# EAGLE design PCB-CMB-2 (EAGLE 6.4)

## Sheet 1 of 2
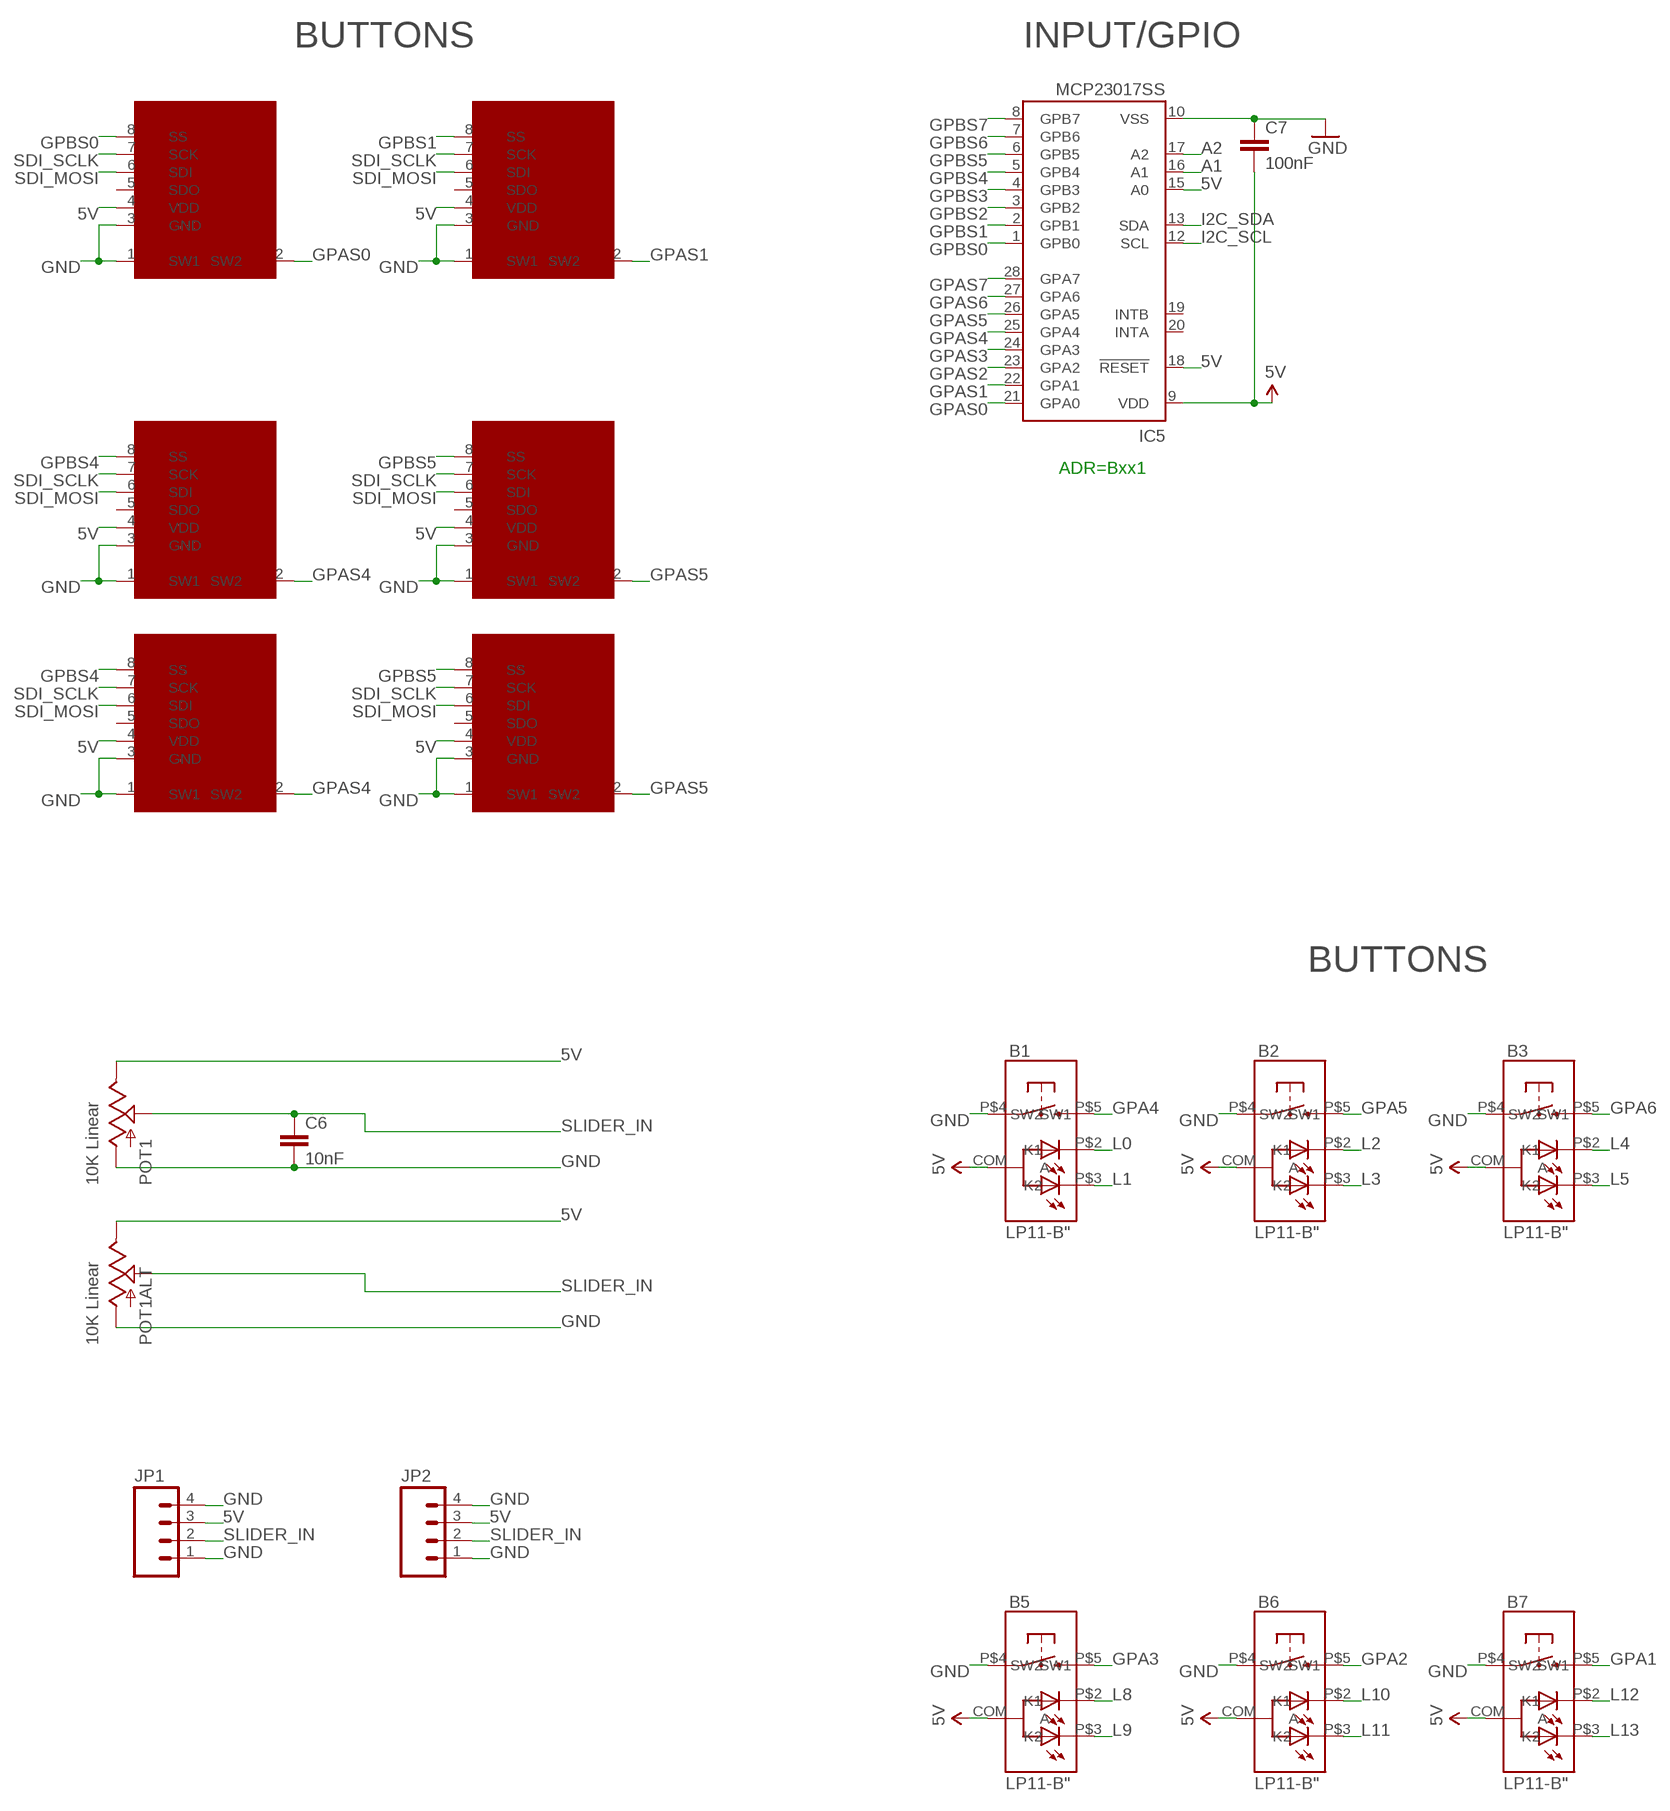
[diagram p0: schematic, sheet 1, part 1 of 2]
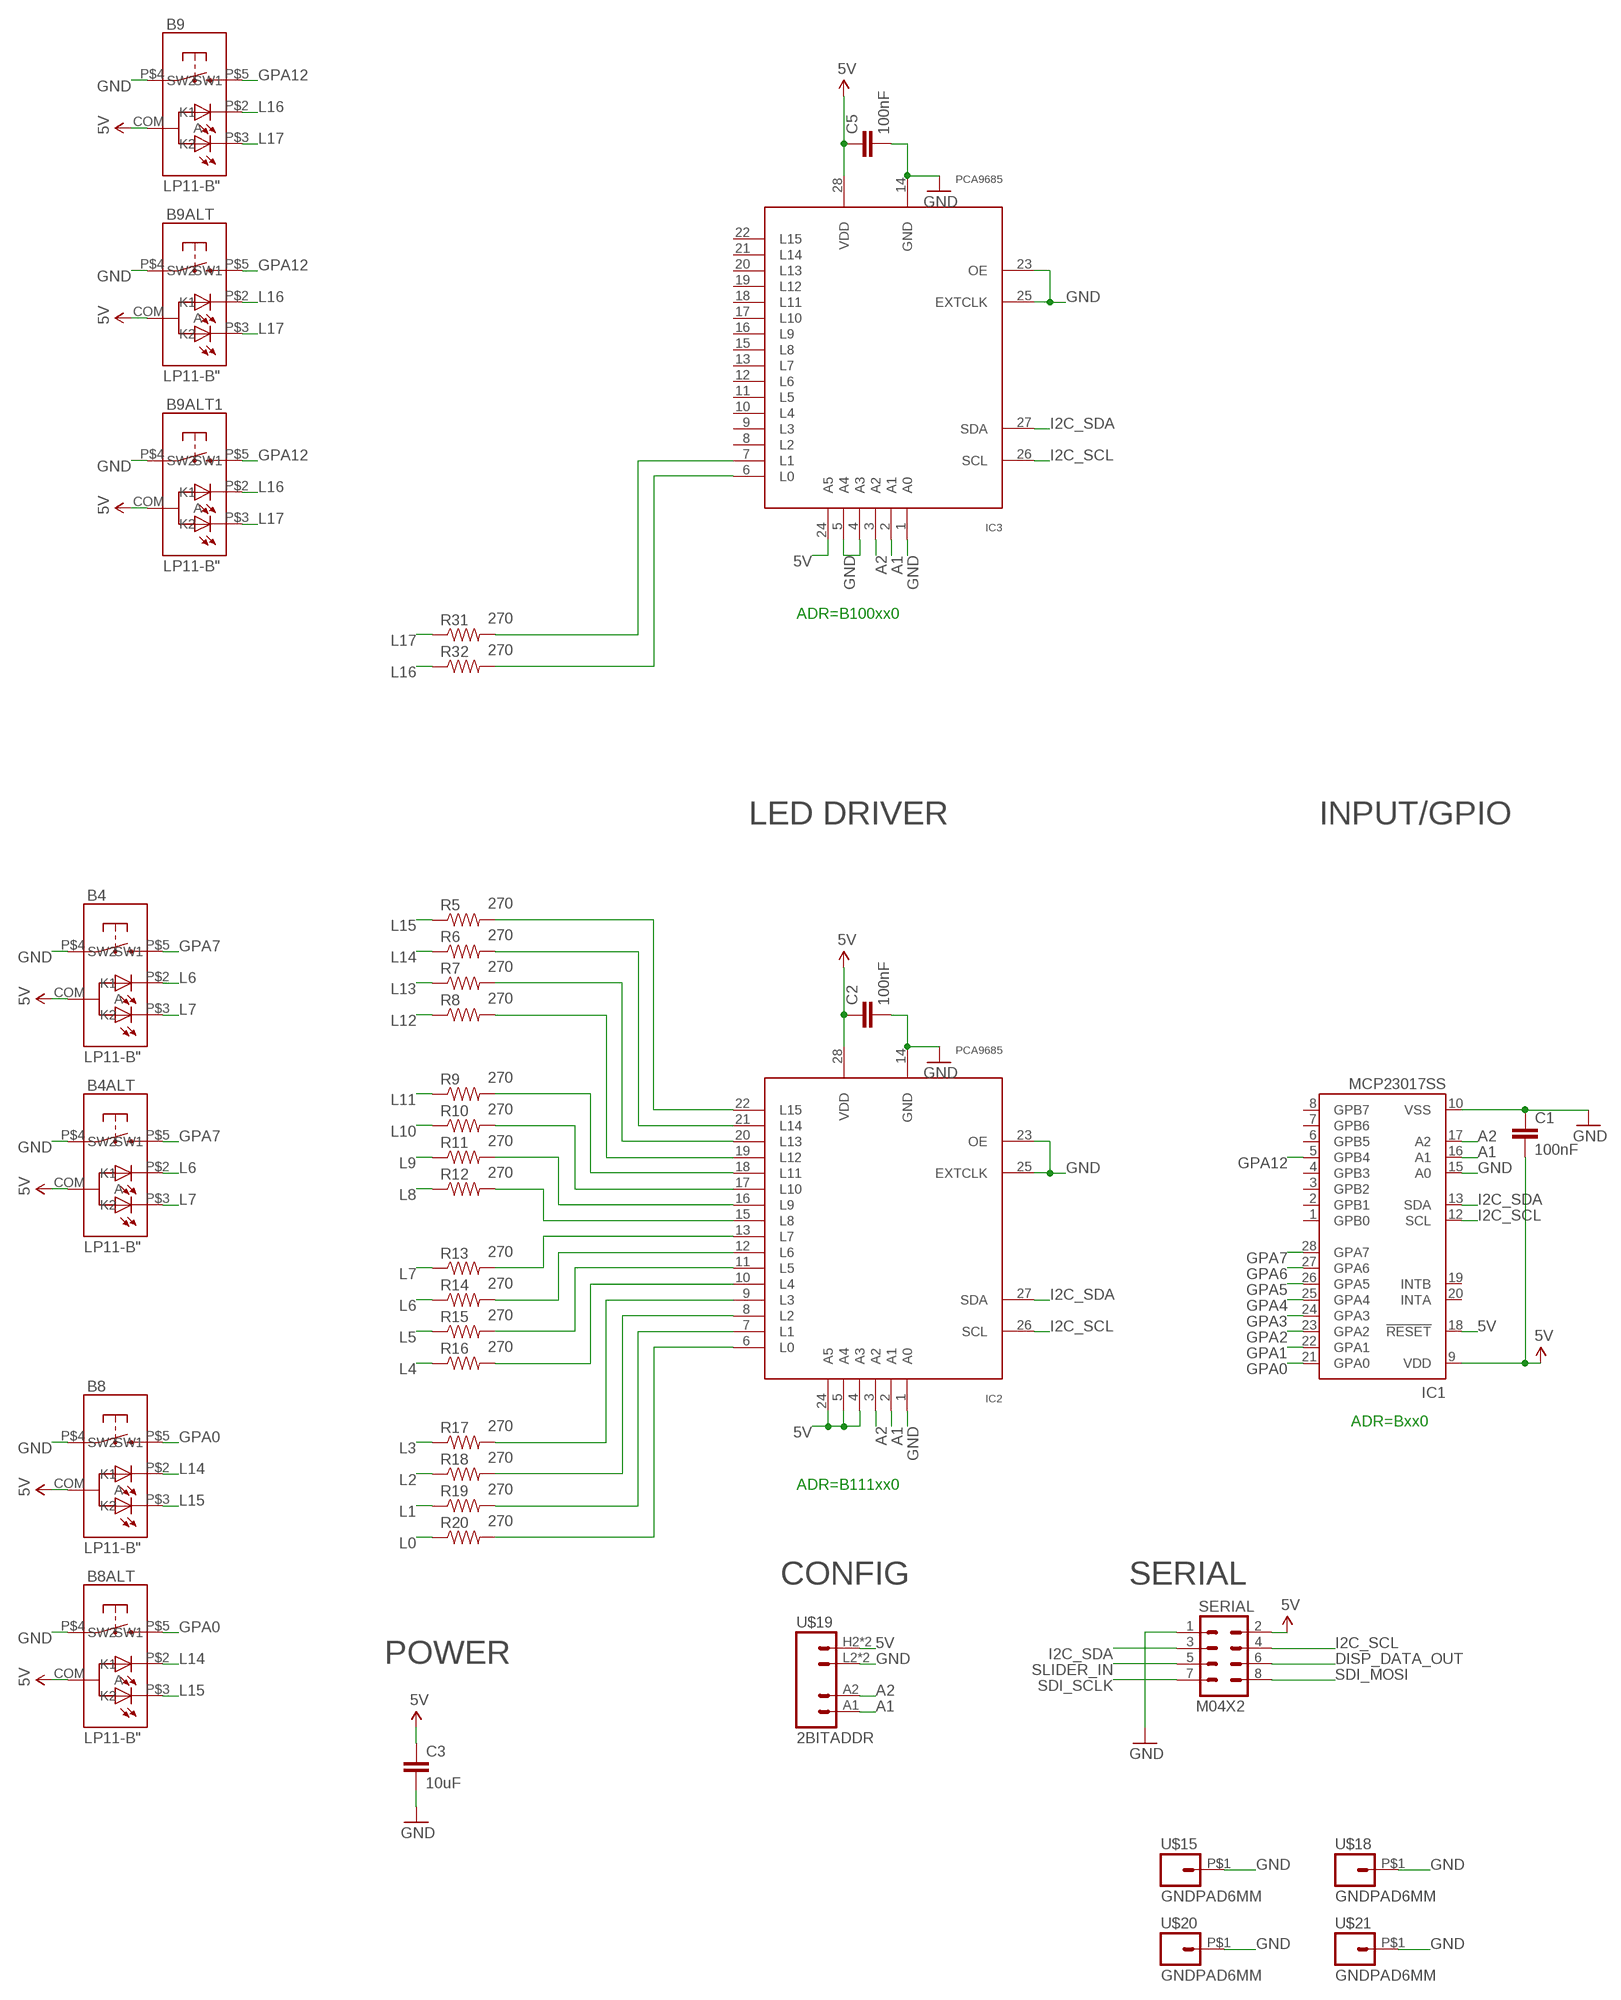
[diagram p1: schematic, sheet 1, part 2 of 2]

### Parts
B1  LP11-B"  [LP11]
B2  LP11-B"  [LP11]
B3  LP11-B"  [LP11]
B4  LP11-B"  [LP11]
B4ALT  LP11-B"  [LP11]
B5  LP11-B"  [LP11]
B6  LP11-B"  [LP11]
B7  LP11-B"  [LP11]
B8  LP11-B"  [LP11]
B8ALT  LP11-B"  [LP11]
B9  LP11-B"  [LP11]
B9ALT  LP11-B"  [LP11]
B9ALT1  LP11-B"  [LP11]
C1  100nF  CAP0603-CAP  [0603-CAP]
C2  100nF  CAP0603-CAP  [0603-CAP]
C3  10uF  CAP0805  [0805]
C5  100nF  CAP0603-CAP  [0603-CAP]
C6  10nF  CAP0603-CAP  [0603-CAP]
C7  100nF  CAP0603-CAP  [0603-CAP]
IC1  MCP23017SS  [SSOP28]
IC2  PCA9685  [TSSOP28]
IC3  PCA9685  [TSSOP28]
IC5  MCP23017SS  [SSOP28]
JP1  M04PTH  [1X04]
JP2  M04PTH  [1X04]
POT1  10K Linear  SLIDER20  [SLIDER20]
POT1ALT  10K Linear  SLIDER20  [SLIDER20]
R5  270  RESISTOR0603-RES  [0603-RES]
R6  270  RESISTOR0603-RES  [0603-RES]
R7  270  RESISTOR0603-RES  [0603-RES]
R8  270  RESISTOR0603-RES  [0603-RES]
R9  270  RESISTOR0603-RES  [0603-RES]
R10  270  RESISTOR0603-RES  [0603-RES]
R11  270  RESISTOR0603-RES  [0603-RES]
R12  270  RESISTOR0603-RES  [0603-RES]
R13  270  RESISTOR0603-RES  [0603-RES]
R14  270  RESISTOR0603-RES  [0603-RES]
R15  270  RESISTOR0603-RES  [0603-RES]
R16  270  RESISTOR0603-RES  [0603-RES]
R17  270  RESISTOR0603-RES  [0603-RES]
R18  270  RESISTOR0603-RES  [0603-RES]
R19  270  RESISTOR0603-RES  [0603-RES]
R20  270  RESISTOR0603-RES  [0603-RES]
R31  270  RESISTOR0603-RES  [0603-RES]
R32  270  RESISTOR0603-RES  [0603-RES]
SERIAL  M04X2  [2X4]
SSW1  SMART_SWITCHSMART_SWITCH_8PIN  [SMART_SWITCH]
SSW2  SMART_SWITCHSMART_SWITCH_8PIN  [SMART_SWITCH]
SSW5  SMART_SWITCHSMART_SWITCH_8PIN  [SMART_SWITCH]
SSW5ALT  SMART_SWITCHSMART_SWITCH_8PIN  [SMART_SWITCH]
SSW6  SMART_SWITCHSMART_SWITCH_8PIN  [SMART_SWITCH]
SSW6ALT  SMART_SWITCHSMART_SWITCH_8PIN  [SMART_SWITCH]
U$15  GNDPAD6MM  [3.2MMPAD6MM]
U$18  GNDPAD6MM  [3.2MMPAD6MM]
U$19  2BITADDR  [2BITADDR]
U$20  GNDPAD6MM  [3.2MMPAD6MM]
U$21  GNDPAD6MM  [3.2MMPAD6MM]

### Nets
5V [Power]: B1.COM(A) B2.COM(A) B3.COM(A) B4.COM(A) B4ALT.COM(A) B5.COM(A) B6.COM(A) B7.COM(A) B8.COM(A) B8ALT.COM(A) B9.COM(A) B9ALT1.COM(A) B9ALT.COM(A) C1.2 C2.1 C3.1 C5.1 C7.2 IC1.9(VDD) IC1.18(!RESET) IC2.4(A3) IC2.5(A4) IC2.24(A5) IC2.28(VDD) IC3.24(A5) IC3.28(VDD) IC5.9(VDD) IC5.15(A0) IC5.18(!RESET) JP1.3 JP2.3 POT1.1(E) POT1ALT.1(E) SERIAL.2 SSW1.4(VDD) SSW2.4(VDD) SSW5.4(VDD) SSW5ALT.4(VDD) SSW6.4(VDD) SSW6ALT.4(VDD) U$19.H2(VCC) U$19.H3(VCC)
A1: IC1.16(A1) IC2.2(A1) IC3.2(A1) IC5.16(A1) U$19.A1
A2: IC1.17(A2) IC2.3(A2) IC3.3(A2) IC5.17(A2) U$19.A2
DISP_DATA_OUT: SERIAL.6
GND [Power]: B1.P$4(SW1) B2.P$4(SW1) B3.P$4(SW1) B4.P$4(SW1) B4ALT.P$4(SW1) B5.P$4(SW1) B6.P$4(SW1) B7.P$4(SW1) B8.P$4(SW1) B8ALT.P$4(SW1) B9.P$4(SW1) B9ALT1.P$4(SW1) B9ALT.P$4(SW1) C1.1 C2.2 C3.2 C5.2 C6.2 C7.1 IC1.10(VSS) IC1.15(A0) IC2.1(A0) IC2.14(GND) IC2.23(OE) IC2.25(EXTCLK) IC3.1(A0) IC3.4(A3) IC3.5(A4) IC3.14(GND) IC3.23(OE) IC3.25(EXTCLK) IC5.10(VSS) JP1.1 JP1.4 JP2.1 JP2.4 POT1.3(A) POT1ALT.3(A) SERIAL.1 SSW1.1(SW1) SSW1.3(GND) SSW2.1(SW1) SSW2.3(GND) SSW5.1(SW1) SSW5.3(GND) SSW5ALT.1(SW1) SSW5ALT.3(GND) SSW6.1(SW1) SSW6.3(GND) SSW6ALT.1(SW1) SSW6ALT.3(GND) U$15.P$1 U$18.P$1 U$19.L2(GND) U$19.L3(GND) U$20.P$1 U$21.P$1
GPA0: B8.P$5(SW2) B8ALT.P$5(SW2) IC1.21(GPA0)
GPA1: B7.P$5(SW2) IC1.22(GPA1)
GPA2: B6.P$5(SW2) IC1.23(GPA2)
GPA3: B5.P$5(SW2) IC1.24(GPA3)
GPA4: B1.P$5(SW2) IC1.25(GPA4)
GPA5: B2.P$5(SW2) IC1.26(GPA5)
GPA6: B3.P$5(SW2) IC1.27(GPA6)
GPA7: B4.P$5(SW2) B4ALT.P$5(SW2) IC1.28(GPA7)
GPA12: B9.P$5(SW2) B9ALT1.P$5(SW2) B9ALT.P$5(SW2) IC1.5(GPB4)
GPAS0: IC5.21(GPA0) SSW1.2(SW2)
GPAS1: IC5.22(GPA1) SSW2.2(SW2)
GPAS2: IC5.23(GPA2)
GPAS3: IC5.24(GPA3)
GPAS4: IC5.25(GPA4) SSW5.2(SW2) SSW5ALT.2(SW2)
GPAS5: IC5.26(GPA5) SSW6.2(SW2) SSW6ALT.2(SW2)
GPAS6: IC5.27(GPA6)
GPAS7: IC5.28(GPA7)
GPBS0: IC5.1(GPB0) SSW1.8(SS)
GPBS1: IC5.2(GPB1) SSW2.8(SS)
GPBS2: IC5.3(GPB2)
GPBS3: IC5.4(GPB3)
GPBS4: IC5.5(GPB4) SSW5.8(SS) SSW5ALT.8(SS)
GPBS5: IC5.6(GPB5) SSW6.8(SS) SSW6ALT.8(SS)
GPBS6: IC5.7(GPB6)
GPBS7: IC5.8(GPB7)
I2C_SCL: IC1.12(SCL) IC2.26(SCL) IC3.26(SCL) IC5.12(SCL) SERIAL.4
I2C_SDA: IC1.13(SDA) IC2.27(SDA) IC3.27(SDA) IC5.13(SDA) SERIAL.3
L0: B1.P$2(K1) R20.1
L1: B1.P$3(K2) R19.1
L2: B2.P$2(K1) R18.1
L3: B2.P$3(K2) R17.1
L4: B3.P$2(K1) R16.1
L5: B3.P$3(K2) R15.1
L6: B4.P$2(K1) B4ALT.P$2(K1) R14.1
L7: B4.P$3(K2) B4ALT.P$3(K2) R13.1
L8: B5.P$2(K1) R12.1
L9: B5.P$3(K2) R11.1
L10: B6.P$2(K1) R10.1
L11: B6.P$3(K2) R9.1
L12: B7.P$2(K1) R8.1
L13: B7.P$3(K2) R7.1
L14: B8.P$2(K1) B8ALT.P$2(K1) R6.1
L15: B8.P$3(K2) B8ALT.P$3(K2) R5.1
L16: B9.P$2(K1) B9ALT1.P$2(K1) B9ALT.P$2(K1) R32.1
L17: B9.P$3(K2) B9ALT1.P$3(K2) B9ALT.P$3(K2) R31.1
N$4: IC2.13(L7) R13.2
N$5: IC2.12(L6) R14.2
N$7: IC2.11(L5) R15.2
N$9: IC2.10(L4) R16.2
N$10: IC2.9(L3) R17.2
N$11: IC2.8(L2) R18.2
N$12: IC2.7(L1) R19.2
N$14: IC3.7(L1) R31.2
N$15: IC3.6(L0) R32.2
N$19: IC2.6(L0) R20.2
N$20: IC2.15(L8) R12.2
N$21: IC2.16(L9) R11.2
N$22: IC2.17(L10) R10.2
N$23: IC2.18(L11) R9.2
N$24: IC2.19(L12) R8.2
N$25: IC2.20(L13) R7.2
N$26: IC2.21(L14) R6.2
N$27: IC2.22(L15) R5.2
SDI_MOSI: SERIAL.8 SSW1.6(SDI) SSW2.6(SDI) SSW5.6(SDI) SSW5ALT.6(SDI) SSW6.6(SDI) SSW6ALT.6(SDI)
SDI_SCLK: SERIAL.7 SSW1.7(SCK) SSW2.7(SCK) SSW5.7(SCK) SSW5ALT.7(SCK) SSW6.7(SCK) SSW6ALT.7(SCK)
SLIDER_IN: C6.1 JP1.2 JP2.2 POT1.2A(S) POT1ALT.2A(S) SERIAL.5
Unconnected: IC1.1(GPB0) IC1.2(GPB1) IC1.3(GPB2) IC1.4(GPB3) IC1.6(GPB5) IC1.7(GPB6) IC1.8(GPB7) IC1.19(INTB) IC1.20(INTA) IC3.8(L2) IC3.9(L3) IC3.10(L4) IC3.11(L5) IC3.12(L6) IC3.13(L7) IC3.15(L8) IC3.16(L9) IC3.17(L10) IC3.18(L11) IC3.19(L12) IC3.20(L13) IC3.21(L14) IC3.22(L15) IC5.19(INTB) IC5.20(INTA) SSW1.5(SDO) SSW2.5(SDO) SSW5.5(SDO) SSW5ALT.5(SDO) SSW6.5(SDO) SSW6ALT.5(SDO)

### Notes on the sheet
- BUTTONS | INPUT/GPIO
- ADR=Bxx1
- ADR=B100xx0
- BUTTONS | LED DRIVER | INPUT/GPIO
- ADR=Bxx0
- ADR=B111xx0
- CONFIG | SERIAL
- POWER

## Sheet 2 of 2

## Library data of the parts
B1-B4 B4ALT B5-B8 B8ALT B9 B9ALT B9ALT1 = SKAARHOJ:LP11-B
C1-C3 C5-C7 = SparkFun:CAP: Capacitor Standard 0603 ceramic capacitor, and 0.1" leaded capacitor.
IC1 IC5 = microchip:MCP23017: http://ww1.microchip.com/downloads/en/DeviceDoc/21952a.pdf Source: http://ww1.microchip.com/downloads/en/DeviceDoc/21952a.pdf; MF: MICROCHIP; MPN: MCP23017-E/SS; OC_FARNELL: 1467674; OC_NEWARK: 31K2960
IC2 IC3 = wsmith:PCA9685
JP1 JP2 = SparkFun:M04: Header 4 Standard 4-pin 0.1" header. Use with straight break away headers (SKU : PRT-00116), right angle break away headers (PRT-00553), swiss pins (PRT-00743), machine pins (PRT-00117), and female headers (PRT-00115). Molex polarized connector foot print use with SKU : PRT-08231 with associated crimp pins and housings. 1MM SMD Version SKU: PRT-10208
POT1 POT1ALT = SKAARHOJ:SLIDER
R5-R20 R31 R32 = SparkFun:RESISTOR: Resistor Basic schematic elements and footprints for 0603, 1206, and PTH resistors.
SERIAL = SparkFun:M04X2
SSW1 SSW2 SSW5 SSW5ALT SSW6 SSW6ALT = SKAARHOJ:SMART_SWITCH: SMARTSWITCH IS15DSBFP4RGB www.nkksmartswitch.com
U$15 U$18 U$20 U$21 = SKAARHOJ:GNDPAD
U$19 = SKAARHOJ:2BITADDR

## Net classes
0 default: width 0.203 mm, drill 0.406 mm, clearance 0.203 mm
1 Power: width 0.406 mm, drill 0.61 mm, clearance 0.203 mm

## Board
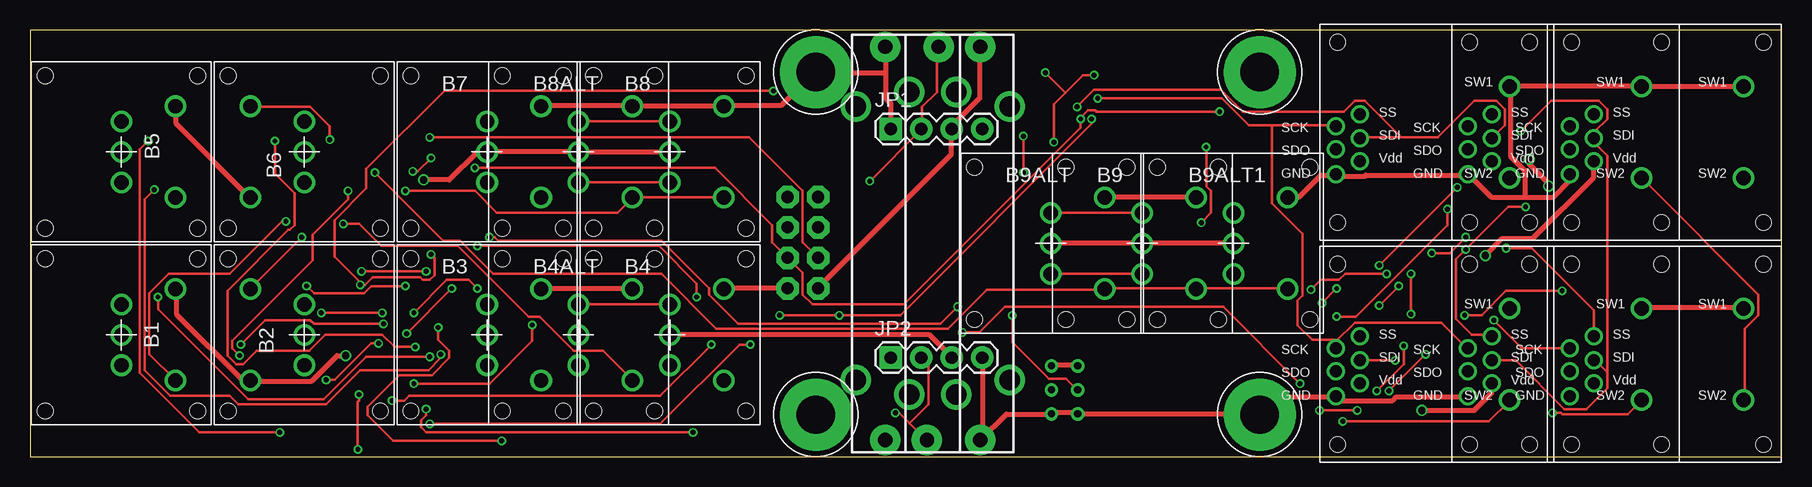
[diagram p2: board, top side]
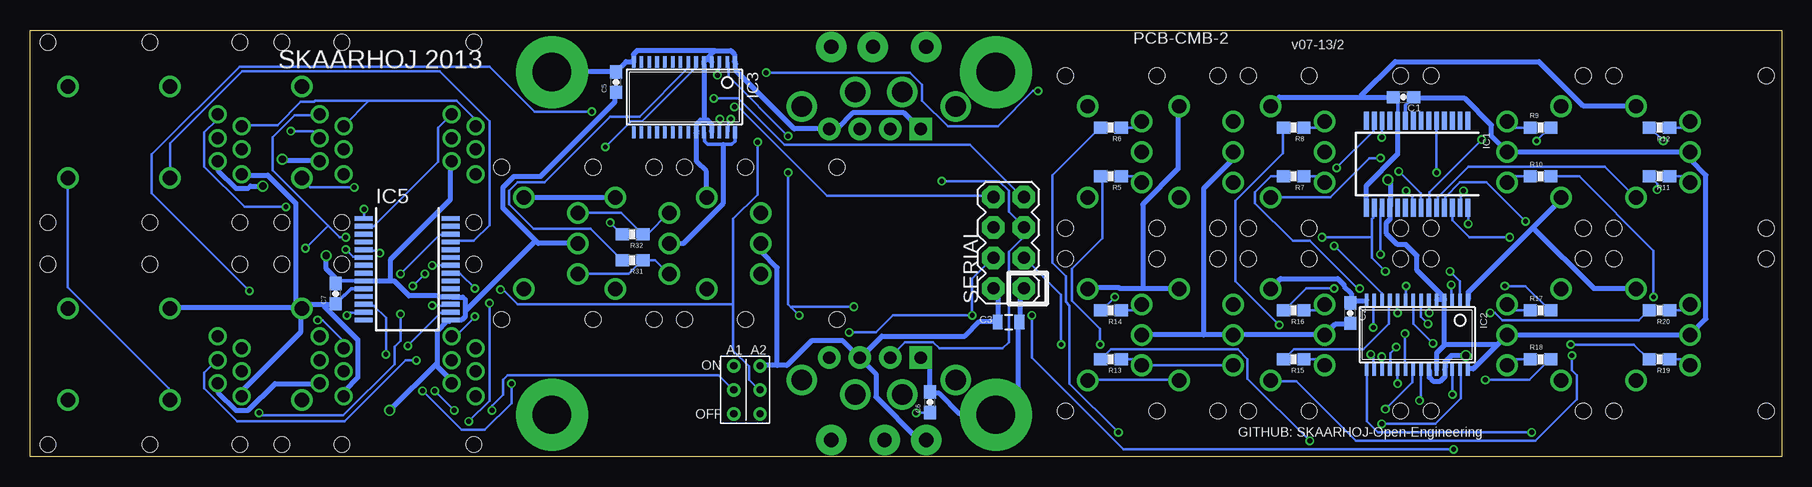
[diagram p3: board, bottom side, seen from below]

Size 146 x 35.56 mm. Coordinates in mm from the lower left corner, seen from the top.
Outline: 0,0 146,0 146,35.56 0,35.56 0,0
Copper layers (1*16): Top 0.035mm / dielectric 1.5mm / Bottom 0.035mm
Design rules "Fusion_eagle_rule_v1.1": minimum track width 6mil, minimum drill 12mil, track to track 6mil, track to pad 6mil, pad to pad 6mil, via to via 6mil, smd to smd 0mil, copper to edge 10mil, drill to drill 10mil, minimum pad ring 10mil, minimum via ring 6mil, stop-mask expansion 2mil, vias tented up to drill 100mil, thermal gap 10mil

### Footprints (pad centres in the part's own frame; a part is rotated, then mirrored left to right if it is on the bottom)
LP11 = drill 1.2: COM 0,0; P$2 0,2.54; P$3 0,-2.54; P$4 4.5,3.81; P$5 4.5,-3.81 | hole 1.3: -6.35,6.35; 6.35,6.35; 6.35,-6.35; -6.35,-6.35
0603-CAP = smd 1.1 x 1: 1 -0.85,0; 2 0.85,0
0805 = smd 0.8 x 1.2: 1 -0.9,0; 2 0.9,0
SSOP28 = smd 0.4 x 1.5: 1 -4.225,-3.625; 2 -3.575,-3.625; 3 -2.925,-3.625; 4 -2.275,-3.625; 5 -1.625,-3.625; 6 -0.975,-3.625; 7 -0.325,-3.625; 8 0.325,-3.625; 9 0.975,-3.625; 10 1.625,-3.625; 11 2.275,-3.625; 12 2.925,-3.625; 13 3.575,-3.625; 14 4.225,-3.625; 15 4.225,3.625; 16 3.575,3.625; 17 2.925,3.625; 18 2.275,3.625; 19 1.625,3.625; 20 0.975,3.625; 21 0.325,3.625; 22 -0.325,3.625; 23 -0.975,3.625; 24 -1.625,3.625; 25 -2.275,3.625; 26 -2.925,3.625; 27 -3.575,3.625; 28 -4.225,3.625
TSSOP28 = smd 0.305 x 0.991: 1 -4.225,-2.918; 2 -3.575,-2.918; 3 -2.925,-2.918; 4 -2.275,-2.918; 5 -1.625,-2.918; 6 -0.975,-2.918; 7 -0.325,-2.918; 8 0.325,-2.918; 9 0.975,-2.918; 10 1.625,-2.918; 11 2.275,-2.918; 12 2.925,-2.918; 13 3.575,-2.918; 14 4.225,-2.918; 15 4.225,2.918; 16 3.575,2.918; 17 2.925,2.918; 18 2.275,2.918; 19 1.625,2.918; 20 0.975,2.918; 21 0.325,2.918; 22 -0.325,2.918; 23 -0.975,2.918; 24 -1.625,2.918; 25 -2.275,2.918; 26 -2.925,2.918; 27 -3.575,2.918; 28 -4.225,2.918
1X04 = drill 1.016 pad 1.88 square: 1 0,0 | drill 1.016 pad 1.88: 2 2.54,0; 3 5.08,0; 4 7.62,0
SLIDER20 = drill 1.194 pad 2.54: 1 -16.383,1.74; 2A -16.383,-1.74; 3 16.383,1.74 | drill 1.702: P$1 -11.392,4.191; P$2 11.392,4.191; P$3 12.598,-4.191; P$4 -12.598,-4.191
0603-RES = smd 1.1 x 1: 1 -0.85,0; 2 0.85,0
2X4 = drill 1.016 pad 1.88 octagon: 1 -3.81,-1.27; 2 -3.81,1.27; 3 -1.27,-1.27; 4 -1.27,1.27; 5 1.27,-1.27; 6 1.27,1.27; 7 3.81,-1.27; 8 3.81,1.27
SMART_SWITCH = drill 1.2: 1 6.35,3.81; 2 6.35,-3.81 | drill 1: 3 -8.153,-3.48; 4 -6.147,-2.413; 5 -8.153,-1.422; 6 -6.147,-0.483; 7 -8.153,0.508; 8 -6.147,1.499 | hole 1.3: -8.001,7.506; 8.001,7.506; 8.001,-7.506; -8.001,-7.506
3.2MMPAD6MM = drill 3.2 pad 6: P$1 0,0
2BITADDR = drill 0.6: A1 0,0; A2 2.2,0; H2 0,2; H3 2.2,2; L2 0,-2; L3 2.2,-2

### Placement (x,y rotation side)
B1  7.62,10.16 0 top
B2  22.86,10.16 180 top
B3  38.1,10.16 0 top
B4  53.34,10.16 0 top
B4ALT  45.72,10.16 0 top
B5  7.62,25.4 0 top
B6  22.86,25.4 180 top
B7  38.1,25.4 0 top
B8  53.34,25.4 0 top
B8ALT  45.72,25.4 0 top
B9  92.71,17.78 0 top
B9ALT  85.09,17.78 0 top
B9ALT1  100.33,17.78 0 top
C1  31.51,29.97 0 bottom
C2  35.96,11.96 90 bottom
C3  64.42,11.21 0 bottom
C5  97.14,31.22 90 bottom
C6  70.97,4.54 90 bottom
C7  120.52,13.59 90 bottom
IC1  30.37,24.38 180 bottom
IC2  30.37,10.16 180 bottom
IC3  91.45,29.97 180 bottom
IC5  114.55,15.62 270 bottom
JP1  71.75,27.3 0 top
JP2  71.75,8.26 0 top
POT1  73.03,17.78 90 top
POT1ALT  77.47,17.78 270 top
R5  55.9,23.37 180 bottom
R6  55.9,27.43 180 bottom
R7  40.66,23.37 180 bottom
R8  40.66,27.43 180 bottom
R9  20.08,27.43 0 bottom
R10  20.08,23.37 0 bottom
R11  10.18,23.37 180 bottom
R12  10.18,27.43 180 bottom
R13  55.9,8.13 180 bottom
R14  55.9,12.19 180 bottom
R15  40.66,8.13 180 bottom
R16  40.66,12.19 180 bottom
R17  20.08,12.19 0 bottom
R18  20.08,8.13 0 bottom
R19  10.18,8.13 180 bottom
R20  10.18,12.19 180 bottom
R31  95.77,16.38 180 bottom
R32  95.77,18.54 180 bottom
SERIAL  64.42,17.84 90 bottom
SSW1  117,8.53 0 top
SSW2  117,27.03 0 top
SSW5  136.5,8.53 0 top
SSW5ALT  128,27.03 0 top
SSW6  136.5,27.03 0 top
SSW6ALT  128,8.53 0 top
U$15  65.5,3.5 0 top
U$18  102.5,3.5 0 top
U$19  87.34,5.57 0 bottom
U$20  65.5,32.06 0 top
U$21  102.5,32.06 0 top

### Tracks (layer width: path | path; a pad name or v marks a point on that pad's centre or on a via)
5V  (via drill 0.61)
  Top 0.406: B9ALT.COM B9.COM B9ALT1.COM | v124.97,24.79 124.97,24.38 126.59,22.76 v126.59,22.55 | v116.03,3.86 120.4,3.86 121.82,5.28 121.82,6.1 SSW6ALT.4 | v121.31,16.76 122.73,18.19 125.27,18.19 130.35,23.27 130.35,24.59 SSW6.4 | B8.COM B8ALT.COM B7.COM 38,25.3 37.19,25.3 34.95,23.06 v32.82,23.06 | POT1ALT.1 79.15,34.14 79.15,29.87 76.91,27.64 76.91,27.33 JP1.3 76.81,27.13 76.81,25.2 65.73,14.12 SERIAL.2 | U$19.H3 85.24,7.62 87.27,7.62 U$19.H2 | B4.COM 74.98,10.16 76.81,8.33 JP2.3
  Bottom 0.305: IC1.9 31.34,29.29 C1.2 | IC5.9 120.32,14.65 C7.2 | IC3.28 87.23,26.31 87.5,26.04 88.19,26.04 89.53,26.04 89.79,26.29 89.79,27.01 IC3.24
  Bottom 0.406: 88.19,26.04 88.19,21.13 91.54,17.78 B9.COM | 103.83,17.98 103.63,17.78 B9ALT1.COM | 103.83,17.98 106.58,20.73 106.58,22.45 105.66,23.37 103.43,23.37 97.23,29.57 97.23,30.28 C5.1 | v124.97,24.79 124.87,24.69 121.92,24.69 SSW5ALT.4 | v126.59,22.55 127.61,22.55 127.81,22.35 128.83,22.35 130.35,23.88 130.35,24.59 SSW6.4 | SSW6ALT.4 121.92,6.1 125.58,6.1 127.81,3.86 128.83,3.86 130.35,5.38 130.35,6.1 SSW5.4 | 109.73,12.19 109.73,13.11 109.93,13.31 110.85,13.31 IC5.18 111.05,13.31 111.86,13.31 111.96,13.41 114.4,13.41 115.62,14.63 115.93,14.63 | 109.73,12.19 109.73,11.68 110.03,11.38 110.85,11.38 IC5.15 111.05,11.28 111.25,11.28 112.06,10.46 112.06,7.72 | 115.93,14.63 118.06,14.63 IC5.9 | 112.06,7.72 112.06,7.52 110.95,6.4 110.95,6.2 SSW1.4 | 115.93,14.63 115.93,16.46 110.95,21.44 110.95,24.59 SSW2.4 | v116.03,3.86 112.17,7.72 112.06,7.72 | v121.31,16.76 121.31,15.65 120.4,14.73 C7.2 | 103.83,17.98 109.63,12.19 109.73,12.19 | C1.2 30.58,29.87 26.42,29.87 24.18,27.64 24.18,26.72 B6.COM B5.COM 7.52,25.3 7.52,24.69 6.3,23.47 6.3,11.48 B1.COM B2.COM 23.77,9.25 | IC2.4 28.14,13.11 28.65,13.11 IC2.5 | 28.14,9.25 28.75,8.64 28.75,7.32 IC2.24 | 28.14,9.25 28.14,12.9 IC2.4 | IC2.4 28.14,13.31 30.38,15.54 30.38,16.76 31.29,17.68 32,17.68 32.92,18.59 32.92,19.51 32.61,19.81 32.61,20.73 IC1.18 32.61,20.93 32.61,22.86 v32.82,23.06 | 23.77,9.25 25.7,7.32 26.11,7.32 IC2.28 | 28.14,9.25 28.04,9.35 23.88,9.35 23.77,9.25 | C2.1 35.97,11.07 37.19,11.07 B3.COM B4ALT.COM 48.16,10.16 | 48.16,10.16 B4.COM | B8ALT.COM 45.72,24.79 48.16,22.35 48.16,10.16 | SERIAL.2 65.63,14.02 65.33,13.72 65.33,11.28 C3.1 65.53,11.28 66.85,11.28 68.07,10.06 74.98,10.06 76.71,8.33 JP2.3
  Bottom 0.406: 83.72,7.62 82.91,7.62 80.87,9.65 78.23,9.65 JP2.3 | 83.72,7.62 85.14,7.62 U$19.H3 | JP2.3 75.49,6.91 75.49,4.98 71.93,1.42 71.32,1.42 POT1.1 | 83.72,7.62 83.72,15.75 85.04,17.07 85.04,17.78 B9ALT.COM
A1  (via drill 0.41)
  Top 0.203: v33.02,15.44 v27.64,15.44 | v82.8,23.67 v82.8,26.72 | v81.89,11.79 81.89,9.55 84.94,6.5 86.36,6.5 87.27,5.59 U$19.A1 | v114.5,9.25 114.5,7.72 v112.27,5.49 | v107.49,3.86 v110.64,3.86 | v38.3,18.29 38.71,18.29 39.01,17.98 52.63,17.98 56.59,14.02 56.59,13.51 59.03,11.07 75.89,11.07 v77.32,12.5
  Bottom 0.203: v27.64,15.44 26.82,14.63 26.82,13.11 IC2.2 | v33.02,15.44 34.14,16.56 34.14,18.29 | 34.14,18.29 34.14,19.81 34.04,19.91 34.04,20.73 IC1.16 | v82.8,26.72 87.78,31.7 87.78,32.82 IC3.2 | v82.8,23.67 82.8,12.7 82.55,12.45 | v81.89,11.79 82.55,12.45 | v114.5,9.25 111.76,11.99 110.95,11.99 IC5.16 | v110.64,3.86 v112.27,5.49 | v107.49,3.86 107.49,4.27 106.58,5.18 106.58,6.4 106.17,6.81 88.59,6.81 87.38,5.59 U$19.A1 | v38.3,18.29 34.14,18.29 | v77.32,12.5 82.5,12.5 82.55,12.45
A2  (via drill 0.41)
  Top 0.203: v33.43,16.87 33.73,16.56 33.73,15.14 33.33,14.73 32.72,14.73 32.51,14.94 28.55,14.94 27.94,14.33 v27.53,14.33 27.53,14.53 25.4,16.66 25.4,19.71 28.04,22.35 28.04,23.98 34.54,30.48 v61.98,30.48 | v88.7,31.8 87.78,31.8 86.31,30.33 | 86.31,30.33 85.34,29.36 v85.34,26.21 | v114.1,14.22 v112.47,12.6 | v113.08,15.24 109.63,15.24 109.12,14.73 107.59,14.73 v106.78,13.92 | 86.31,30.33 v84.63,32
  Bottom 0.203: v27.53,14.33 27.53,13.11 IC2.3 | v33.43,16.87 33.43,20.62 33.33,20.73 IC1.17 | v88.7,31.8 88.59,31.9 88.59,32.82 IC3.3 | v85.34,26.21 85.34,21.84 87.38,19.81 87.38,12.7 | 87.38,12.7 87.38,8.84 86.06,7.52 86.06,6.4 85.24,5.59 U$19.A2 | v112.47,12.6 110.95,12.6 IC5.17 | v113.08,15.24 v114.1,14.22 | v106.78,13.92 106.58,13.92 105.36,12.7 87.38,12.7 | v61.98,30.48 62.38,30.48 65.33,27.53 69.49,27.53 71.63,29.67 71.63,30.99 72.64,32 v84.63,32
GND  (via drill 0.61)
  Top 0.406: SSW6ALT.1 134.42,12.39 142.85,12.39 SSW5.1 | JP2.4 79.45,8.23 79.45,1.83 POT1ALT.3 79.25,1.42 81.38,3.56 84.94,3.56 U$19.L3 85.24,3.66 87.27,3.66 U$19.L2 87.48,3.56 102.31,3.56 U$18.P$1 102.51,3.56 103.94,4.98 108.81,4.98 SSW1.3 109.02,4.98 109.32,4.67 113.59,4.67 113.89,4.98 119.79,4.98 SSW6ALT.3 | SSW6.1 142.85,30.89 134.52,30.89 SSW5ALT.1 134.31,30.89 123.44,30.89 SSW2.1 123.44,30.68 123.44,24.99 124.66,23.77 124.66,21.64 | B9ALT.P$4 89.61,21.64 97.13,21.64 B9.P$4 | B9ALT1.P$4 104.85,21.64 105.77,21.64 107.59,23.47 108.81,23.47 SSW2.3 108.92,23.37 111.25,23.37 111.35,23.47 119.79,23.47 SSW5ALT.3 119.99,23.47 121.82,21.64 124.66,21.64 | 124.66,21.64 127,21.64 128.32,22.96 128.32,23.47 SSW6.3 | B4ALT.P$4 50.19,14.02 42.67,14.02 B3.P$4 | B4.P$4 57.91,14.02 63.09,14.02 SERIAL.1 | v26.31,8.43 25.6,8.43 23.47,6.3 18.39,6.3 B2.P$4 18.19,6.4 17.68,6.4 12.19,11.89 12.19,13.92 B1.P$4 | B5.P$4 12.19,29.16 12.19,27.74 18.29,21.64 B6.P$4 | B7.P$4 42.67,29.26 50.19,29.26 B8ALT.P$4 50.39,29.26 57.81,29.26 B8.P$4 58.01,29.26 62.59,29.26 65.33,32 U$20.P$1 65.53,32 71.32,32 | 71.32,32 71.32,34.14 POT1.3 | 71.32,32 71.32,29.87 71.73,29.46 71.73,27.33 JP1.1
  Bottom 0.305: IC1.10 32,29.6 C1.1 | IC5.10 119.23,14 119.76,13.46 119.8,13.46 C7.1
  Bottom 0.406: 121.51,12.7 123.04,12.7 123.34,12.39 SSW1.1 | 121.51,12.7 120.6,12.7 C7.1 | SSW6ALT.3 119.79,5.08 119.79,5.49 118.67,6.6 118.67,9.75 121.51,12.6 121.51,12.7 | SSW5.3 128.32,5.08 128.32,5.49 123.44,10.36 123.44,12.19 SSW1.1 | SSW6ALT.1 134.31,12.39 123.55,12.39 SSW1.1 | U$21.P$1 102.41,32.11 97.33,32.11 C5.2 97.13,32.11 96.32,32.92 95.71,32.92 IC3.14 95.71,33.12 95.71,33.53 95.4,33.83 89.1,33.83 89,33.73 | 89.81,28.04 90.12,28.04 90.42,27.74 90.42,27.13 IC3.23 90.42,26.92 90.42,24.59 89.61,23.77 89.61,21.64 B9ALT.P$4 | 89.81,28.04 89.51,28.04 89.2,27.74 89.2,27.13 IC3.25 | 89.51,33.22 89.81,32.92 IC3.5 89.81,32.72 89.81,28.04 | 89.51,33.22 89,33.73 | 89,33.73 88.9,33.83 87.58,33.83 87.27,33.53 87.27,32.92 IC3.1 87.17,32.72 87.17,32.21 82.3,27.33 79.55,27.33 JP1.4 79.35,27.33 78.74,27.33 77.42,28.65 73.15,28.65 71.83,27.33 JP1.1 | 89.51,33.22 89.2,32.92 IC3.4 | B9.P$4 97.23,21.64 104.75,21.64 B9ALT1.P$4 | IC2.14 34.65,13.01 35.76,13.01 35.87,12.9 C2.2 35.87,13.11 35.87,13.61 36.47,14.22 36.47,14.33 36.98,14.83 41.76,14.83 42.57,14.02 B3.P$4 | SERIAL.1 63.2,14.02 63.5,13.72 63.5,11.28 C3.2 63.6,11.07 63.6,5.69 65.53,3.76 U$15.P$1 65.53,3.56 68.48,3.56 70.21,5.28 70.81,5.28 C6.2 71.02,5.49 71.02,7.52 JP2.1 | 53.24,14.02 55.17,14.02 55.27,14.12 57.71,14.12 57.81,14.02 B4.P$4 | 53.24,14.02 50.29,14.02 B4ALT.P$4 | IC2.23 29.36,7.21 29.36,6.6 29.06,6.3 28.45,6.3 28.04,6.71 28.04,7.21 IC2.25 28.04,7.42 28.04,7.92 27.53,8.43 v26.31,8.43 | 20.73,19.1 18.29,21.54 B6.P$4 | 20.73,19.1 26.11,13.72 26.11,13.11 IC2.1 | 20.73,19.1 15.65,14.02 12.19,14.02 B1.P$4
  Bottom 0.406: IC1.15 34.65,20.83 34.65,22.55 32,25.2 32,27.94 IC1.10 | 35.05,29.97 41.86,29.97 42.57,29.26 B7.P$4 | 35.05,29.97 C1.1 | B5.P$4 12.19,29.26 16.56,29.26 20.22,32.92 32.21,32.92 35.05,30.07 35.05,29.97 | 53.24,14.02 53.24,21.03 50.29,23.98 50.29,29.16 B8ALT.P$4 | SSW1.1 123.85,12.5 123.85,21.13 126.19,23.47 128.32,23.47 SSW6.3
GPA0  (via drill 0.41)
  Top 0.203: v31.29,22.15 37.08,22.15 38.91,20.32 48.97,20.32 50.19,21.54 B8ALT.P$5 50.29,21.64 57.81,21.64 B8.P$5
  Bottom 0.203: v31.29,22.15 30.79,21.64 30.79,20.83 IC1.21
GPA1  (via drill 0.41)
  Top 0.203: v31.9,23.77 32.31,23.77 v33.43,24.89
  Bottom 0.203: v31.9,23.77 30.07,21.95 30.07,20.83 IC1.22 | v33.43,24.89 34.34,24.89 37.59,21.64 42.57,21.64 B7.P$5
GPA2  (via drill 0.41)
  Top 0.203: v24.99,26.42 24.99,27.53 23.37,29.16 18.39,29.16 B6.P$5
  Bottom 0.203: v24.99,26.42 29.36,22.05 29.36,20.83 IC1.23
GPA3
  Bottom 0.203: IC1.24 28.65,20.83 28.65,21.64 26.11,24.18 14.73,24.18 12.19,21.64 B5.P$5
GPA4  (via drill 0.41)
  Top 0.203: v21.34,19.61 21.03,19.61 16.66,15.24 11.58,15.24 9.96,13.61 9.96,8.53 12.09,6.4 B1.P$5
  Bottom 0.203: v21.34,19.61 24.59,22.86 26.82,22.86 28.04,21.64 28.04,20.83 IC1.25
GPA5  (via drill 0.41)
  Top 0.203: v22.66,18.29 18.39,14.02 B2.P$5
  Bottom 0.203: v22.66,18.29 26.01,18.29 27.43,19.71 27.43,20.73 IC1.26
GPA6  (via drill 0.41)
  Top 0.203: v26.52,22.15 26.52,21.44 23.57,18.49 23.57,16.36 16.87,9.65 16.87,9.04 v17.48,8.43
  Bottom 0.203: v26.52,22.15 26.72,21.95 26.72,20.83 IC1.27 | v17.48,8.43 17.48,7.21 17.07,6.81 17.07,4.78 20.52,1.32 35.46,1.32 40.44,6.3 42.57,6.3 B3.P$5
GPA7  (via drill 0.41)
  Top 0.203: v26.11,19.41 27.43,19.41 29.26,17.58 35.66,17.58 41.55,11.68 42.47,11.68 45.31,8.84 47.75,8.84 50.19,6.4 B4ALT.P$5
  Bottom 0.203: v26.11,19.41 26.11,20.73 IC1.28 | B4.P$5 57.81,6.4 50.29,6.4 B4ALT.P$5
GPA12  (via drill 0.41)
  Top 0.203: B9ALT1.P$5 104.75,14.02 97.23,14.02 B9.P$5 97.13,14.02 89.61,14.02 B9ALT.P$5 89.51,13.92 79.76,13.92 76.5,10.67 57.2,10.67 52.63,15.24 38.61,15.24 35.87,17.98 34.44,17.98 v28.75,23.67
  Bottom 0.203: v28.75,23.67 28.75,27.94 IC1.5
GPAS0  (via drill 0.41)
  Top 0.203: v107.7,12.8 v108.92,14.02 | v109.42,2.95 121.61,2.95 123.34,4.67 SSW1.2
  Bottom 0.203: v108.92,14.02 110.13,15.24 110.85,15.24 IC5.21 | v107.7,12.8 107.7,4.67 v109.42,2.95
GPAS1  (via drill 0.41)
  Top 0.203: v118.97,22.45 v112.47,15.95
  Bottom 0.203: v112.47,15.95 110.95,15.95 IC5.22 | v118.97,22.45 122.63,22.45 123.34,23.16 SSW2.2
GPAS4
  Top 0.203: SSW5.2 142.95,4.78 142.95,10.67 144.07,11.79 144.07,13.51 134.42,23.16 SSW5ALT.2
  Bottom 0.203: IC5.25 110.85,17.98 109.02,17.98 107.7,19.3 107.7,27.94 111.86,32.11 128.32,32.11 134.31,26.11 134.31,23.27 SSW5ALT.2
GPAS5  (via drill 0.41)
  Top 0.203: v115.11,11.89 v115.11,15.24 | v126.9,3.66 127.61,3.66 127.71,3.56 133.2,3.56 134.31,4.67 SSW6ALT.2
  Bottom 0.203: v115.11,15.24 111.86,18.49 110.95,18.49 IC5.26 | v115.11,11.89 115.11,9.65 115.62,9.14 115.62,7.72 119.89,3.45 126.69,3.45 v126.9,3.66 | SSW6.2 142.85,23.16 142.85,14.12 134.42,5.69 134.42,4.78 SSW6ALT.2
GPBS0  (via drill 0.41)
  Top 0.203: v118.16,20.62 118.16,19.3 110.54,11.68 v108.92,11.68
  Bottom 0.203: v118.16,20.62 118.16,19.91 IC5.1 | v108.92,11.68 110.54,10.06 110.85,10.06 SSW1.8
GPBS1
  Bottom 0.203: IC5.2 118.16,19.2 117.35,19.2 111.96,24.59 111.96,27.43 110.95,28.45 SSW2.8
GPBS4  (via drill 0.41)
  Top 0.203: v116.84,16.97 118.36,16.97 v119.69,18.29 | v123.04,17.37 125.17,17.37 130.35,12.19 130.35,10.06 SSW5.8
  Bottom 0.203: v116.84,16.97 117.04,17.17 118.16,17.17 IC5.5 | v119.69,18.29 120.19,18.29 121.16,19.25 | 121.16,19.25 125.78,23.88 125.78,26.62 123.95,28.45 121.92,28.45 SSW5ALT.8 | 121.16,19.25 v123.04,17.37
GPBS5  (via drill 0.41)
  Top 0.203: SSW6ALT.8 121.82,10.06 121.72,10.16 120.19,10.16 118.87,11.48 118.87,16.46 v119.69,17.27 123.24,20.83 v124.66,20.83
  Bottom 0.203: v119.69,17.27 119.08,16.66 118.26,16.66 IC5.6 | v124.66,20.83 128.12,20.83 131.47,24.18 131.47,27.03 130.45,28.04 130.45,28.45 SSW6.8
I2C_SCL  (via drill 0.41)
  Top 0.203: v27.43,5.18 27.43,4.67 27.33,4.57 v27.33,0.61 | v62.48,11.79 v67.46,11.79 72.54,11.79 88.49,27.74 v88.49,28.14 | v113.28,5.49 v116.33,8.53 | v105.87,6.1 99.47,12.5 81.28,12.5 79.15,10.36 v77.72,10.36 | v33.33,26.62 59.94,26.62 64.41,22.15 64.41,17.88 65.63,16.66 SERIAL.4
  Bottom 0.203: v27.43,5.18 27.43,7.21 IC2.26 | v27.33,0.61 54.86,0.61 62.48,8.23 v62.48,11.79 | SERIAL.4 65.73,16.56 67.46,14.83 v67.46,11.79 74.07,11.79 75.49,10.36 v77.72,10.36 | v88.49,28.14 88.49,27.13 IC3.26 | v116.33,8.53 116.33,11.58 117.35,12.6 118.16,12.6 IC5.12 | v113.28,5.49 110.03,2.23 108.1,2.23 105.87,4.47 v105.87,6.1 | v33.33,26.62 33.33,27.94 IC1.12
I2C_SDA  (via drill 0.41)
  Top 0.203: v33.33,2.74 52.53,2.74 59.13,9.35 v60.05,9.35 | v37.08,24.08 57.1,24.08 61.87,19.3 61.87,17.88 63.09,16.66 SERIAL.3 63.2,16.56 64.41,15.34 64.41,13.51 65.23,12.7 72.85,12.7 87.58,27.43 v87.58,28.14 87.58,28.25 88.19,28.85 88.8,28.85 88.9,28.75 v99.16,28.75 | v119.58,11.79 121.01,11.79 123.04,13.82 v127.71,13.82
  Bottom 0.203: v33.33,2.74 28.85,2.74 26.72,4.88 26.72,7.21 IC2.27 | v60.05,9.35 60.05,13.51 63.09,16.56 SERIAL.3 | v87.58,28.14 87.78,27.94 87.78,27.13 IC3.27 | v37.08,24.08 34.04,27.13 34.04,27.94 IC1.13 | v119.58,11.79 119.38,11.99 118.26,11.99 IC5.13 | v127.71,13.82 135.84,21.95 135.84,25.2 128.52,32.51 107.7,32.51 103.94,28.75 v99.16,28.75
L0
  Bottom 0.203: R20.1 8.13,12.19 B1.P$2
L1
  Bottom 0.203: R19.1 8.13,8.13 B1.P$3
L2
  Bottom 0.203: R18.1 22.35,8.13 B2.P$2
L3
  Bottom 0.203: R17.1 22.35,12.19 B2.P$3
L4
  Bottom 0.203: R16.1 38.61,12.19 B3.P$2
L5
  Bottom 0.203: R15.1 38.61,8.13 B3.P$3
L6
  Top 0.203: B4.P$2 B4ALT.P$2
  Bottom 0.203: R14.1 53.85,12.19 B4.P$2
L7
  Bottom 0.203: R13.1 53.85,8.13 B4.P$3 B4ALT.P$3
L8
  Bottom 0.203: R12.1 8.13,27.43 B5.P$2
L9
  Bottom 0.203: R11.1 8.13,23.37 B5.P$3
L10
  Bottom 0.203: R10.1 22.35,23.37 B6.P$2
L11
  Bottom 0.203: R9.1 22.35,27.43 B6.P$3
L12
  Bottom 0.203: R8.1 38.61,27.43 B7.P$2
L13
  Bottom 0.203: R7.1 38.61,23.37 B7.P$3
L14
  Top 0.203: B8.P$2 B8ALT.P$2
  Bottom 0.203: R6.1 53.85,27.43 B8.P$2
L15
  Top 0.203: B8.P$3 B8ALT.P$3
  Bottom 0.203: R5.1 53.85,23.37 B8.P$3
L16
  Top 0.203: B9.P$2 B9ALT.P$2
  Bottom 0.203: B9.P$2 92.76,20.32 94.49,18.59 94.89,18.59 R32.1 95,18.59 96.72,20.32 B9ALT1.P$2
L17
  Top 0.203: B9.P$3 B9ALT.P$3
  Bottom 0.203: B9.P$3 92.76,15.24 93.88,16.36 94.89,16.36 R31.1 95,16.36 96.11,15.24 B9ALT1.P$3
N$4  (via drill 0.41)
  Top 0.203: v34.04,10.77 34.04,9.75 34.95,8.84 34.95,8.23 33.53,6.81 30.79,6.81 28.14,4.17 28.14,3.45 30.28,1.32 v39.32,1.32
  Bottom 0.203: v34.04,10.77 34.04,13.01 IC2.13 | v39.32,1.32 44.5,6.5 44.5,8.13 45.31,8.94 55.88,8.94 56.69,8.13 R13.2
N$5  (via drill 0.41)
  Top 0.203: v37.29,17.58 52.43,17.58 55.58,14.43 v55.58,13.31
  Bottom 0.203: v37.29,17.58 33.33,13.61 33.33,13.11 IC2.12 | v55.58,13.31 56.69,12.19 R14.2
N$7
  Bottom 0.203: IC2.11 32.72,13.01 32.72,11.07 34.85,8.94 40.64,8.94 41.45,8.13 R15.2
N$9  (via drill 0.41)
  Top 0.203: v32,11.99 34.75,14.73 36.58,14.73 v37.29,14.02
  Bottom 0.203: v32,11.99 32,13.01 IC2.10 | v37.29,14.02 39.62,14.02 41.45,12.19 R16.2
N$10  (via drill 0.41)
  Top 0.203: v31.29,14.22 28.45,14.22 27.84,13.61 23.67,13.61 v23.06,14.22
  Bottom 0.203: v31.29,14.22 31.29,13.11 IC2.9 | v23.06,14.22 21.34,14.22 19.3,12.19 R17.2
N$11  (via drill 0.41)
  Top 0.203: v29.06,9.45 28.45,9.45 25.4,6.4 v24.69,6.4
  Bottom 0.203: v29.06,9.45 30.68,11.07 30.68,13.01 IC2.8 | v24.69,6.4 21.03,6.4 19.3,8.13 R18.2
N$12  (via drill 0.41)
  Top 0.203: v29.46,11.07 23.67,11.07 23.37,11.38 19.61,11.38 v17.58,9.35
  Bottom 0.203: v29.46,11.07 30.07,11.68 30.07,13.01 IC2.7 | v17.58,9.35 12.29,9.35 11.07,8.13 R19.2
N$14
  Bottom 0.203: IC3.7 91.14,32.82 91.14,32.41 95.2,28.35 97.64,28.35 103.12,22.86 105.36,22.86 106.07,22.15 106.07,21.03 104.04,19 99.26,19 96.72,16.46 R31.2
N$15  (via drill 0.41)
  Top 0.203: v98.04,25.81 98.04,22.55 98.45,22.15 98.45,20.32 v97.64,19.51
  Bottom 0.203: v98.04,25.81 95.91,27.94 95,27.94 90.53,32.41 90.53,32.82 IC3.6 | v97.64,19.51 96.72,18.59 R32.2
N$19  (via drill 0.41)
  Top 0.203: v24.28,11.99 v29.36,11.99
  Bottom 0.203: v29.36,11.99 29.36,13.01 IC2.6 | v24.28,11.99 23.88,11.99 23.27,11.38 11.89,11.38 11.07,12.19 R20.2
N$20  (via drill 0.41)
  Top 0.203: v20.83,2.03 14.12,2.03 9.14,7.01 9.14,25.6 v9.86,26.31
  Bottom 0.203: v20.83,2.03 33.63,2.03 34.54,2.95 34.54,7.21 IC2.15 | v9.86,26.31 10.97,27.43 R12.2
N$21  (via drill 0.41)
  Top 0.203: v34.24,8.53 34.24,8.23 33.22,7.21 27.53,7.21 24.69,4.37 17.37,4.37 16.66,5.08 11.68,5.08 9.55,7.21 9.55,21.44 v10.36,22.25
  Bottom 0.203: v34.24,8.53 34.04,8.33 34.04,7.32 IC2.16 | v10.36,22.25 10.36,22.76 10.97,23.37 R11.2
N$22  (via drill 0.41)
  Top 0.203: v33.33,8.33 28.04,8.33 24.49,4.78 18.19,4.78 10.67,12.29 v10.67,13.31
  Bottom 0.203: v33.33,8.33 33.33,7.32 IC2.17 | v10.67,13.31 10.67,17.17 16.87,23.37 R10.2
N$23  (via drill 0.41)
  Top 0.203: v32.11,9.14 30.38,9.14 29.36,10.16 24.59,10.16 23.27,8.84 18.9,8.84 17.78,7.72 17.17,7.72 16.46,8.43 16.46,13.82 21.54,18.9 21.64,18.9 22.05,19.3 22.05,21.95 20.42,23.57 v20.42,26.31
  Bottom 0.203: v32.11,9.14 32.61,8.64 32.61,7.32 IC2.18 | v20.42,26.31 19.3,27.43 R9.2
N$24  (via drill 0.41)
  Top 0.203: v32,6.1 38.3,6.1 41.86,9.65 v41.86,10.97
  Bottom 0.203: v32,6.1 32,7.21 IC2.19 | v41.86,10.97 45.52,14.63 45.52,21.34 41.55,25.3 41.55,27.43 R8.2
N$25  (via drill 0.41)
  Top 0.203: v35.15,14.02 v31.39,10.26
  Bottom 0.203: v31.39,10.26 31.39,7.32 IC2.20 | v35.15,14.02 35.36,14.02 39.32,17.98 40.74,17.98 43.89,21.13 43.89,22.05 42.57,23.37 R7.2
N$26  (via drill 0.41)
  Top 0.203: v33.02,3.96 33.02,3.45 32.61,3.05 32.61,2.44 33.02,2.03 v55.27,2.03
  Bottom 0.203: v33.02,3.96 30.79,6.2 30.79,7.21 IC2.21 | v55.27,2.03 59.33,6.1 59.33,12.6 59.64,12.9 59.64,15.04 60.76,16.15 60.76,23.47 56.79,27.43 R6.2
N$27  (via drill 0.41)
  Top 0.203: v30.18,4.67 31.19,4.67 31.6,5.08 52.53,5.08 v56.79,9.35
  Bottom 0.203: v30.18,4.67 30.07,4.78 30.07,7.21 IC2.22 | v56.79,9.35 56.79,10.67 59.13,13.01 59.13,15.65 56.59,18.19 56.59,23.27 56.69,23.37 R5.2
SDI_MOSI  (via drill 0.41)
  Top 0.203: v113.79,8.03 110.95,8.03 SSW1.6 | 131.42,7.06 130.45,8.03 SSW5.6 | 131.42,7.06 131.47,7.01 131.47,5.69 129.74,3.96 127.91,3.96 123.85,8.03 121.92,8.03 SSW6ALT.6 | 131.42,7.06 131.47,7.11 131.47,25.09 130.45,26.11 130.45,26.52 SSW6.6 130.45,26.62 130.45,27.13 131.47,28.14 131.47,28.96 130.76,29.67 126.8,29.67 v124.26,27.13 | 114.3,26.62 117.35,26.62 120.4,29.67 122.22,29.67 122.94,28.96 122.94,27.64 121.92,26.62 SSW5ALT.6 | 114.3,26.62 110.95,26.62 SSW2.6 | v87.27,29.16 88.7,30.58 99.26,30.58 101.09,28.75 109.53,28.75 110.44,29.67 111.25,29.67 114.3,26.62
  Bottom 0.203: v113.79,8.03 114.71,8.03 119.79,2.95 128.73,2.95 131.47,5.69 131.47,7.01 130.45,8.03 SSW5.6 | v87.27,29.16 86.97,29.16 79.55,21.74 65.73,21.74 SERIAL.8 | v124.26,27.13 122.43,27.13 121.92,26.62 SSW5ALT.6
SDI_SCLK  (via drill 0.41)
  Top 0.203: SSW6ALT.7 119.79,9.04 117.65,11.18 110.44,11.18 108.92,9.65 108.92,9.04 SSW1.7 108.92,9.75 106.88,9.75 105.66,10.97 105.66,13.01 106.07,13.41 106.07,18.59 103.53,21.13 103.53,27.64 | v122.02,11.38 124.36,9.04 128.32,9.04 SSW5.7 | v89,29.87 99.36,29.87 101.6,27.64 103.53,27.64 | 103.53,27.64 108.81,27.64 SSW2.7
  Bottom 0.203: v122.02,11.38 121.61,11.38 119.89,9.65 119.89,9.04 SSW6ALT.7 | 117.81,29.62 119.79,27.64 SSW5ALT.7 | 117.81,29.62 117.75,29.67 110.44,29.67 108.92,28.14 108.92,27.64 SSW2.7 | SSW6.7 128.32,27.64 125.37,27.64 123.44,29.57 122.33,29.57 122.22,29.67 117.86,29.67 117.81,29.62 | v89,29.87 86.97,29.87 83.11,26.01 67.67,26.01 63.4,21.74 63.2,21.74 SERIAL.7
SLIDER_IN  (via drill 0.41)
  Top 0.203: POT1ALT.2A 75.69,34.14 75.59,34.04 75.59,30.38 74.37,29.16 74.37,27.33 JP1.2 74.27,27.23 v70,22.96 | v72.14,3.66 72.44,3.66 73.3,2.79 | 73.3,2.79 74.68,1.42 POT1.2A | 73.3,2.79 74.88,4.37 74.88,7.72 74.37,8.23 JP2.2
  Bottom 0.203: v72.14,3.66 71.02,3.66 C6.1 | JP2.2 74.27,8.33 73.05,9.55 70.71,9.55 70.21,9.04 64.92,9.04 64.41,9.55 64.41,17.07 63.2,18.29 63.2,19.1 SERIAL.5 63.2,19.2 64.41,20.42 64.41,22.15 65.23,22.96 v70,22.96

### Text on the board
_bsilk: v07-13/2 | PCB-CMB-2 | SKAARHOJ 2013 | GITHUB: SKAARHOJ-Open-Engineering